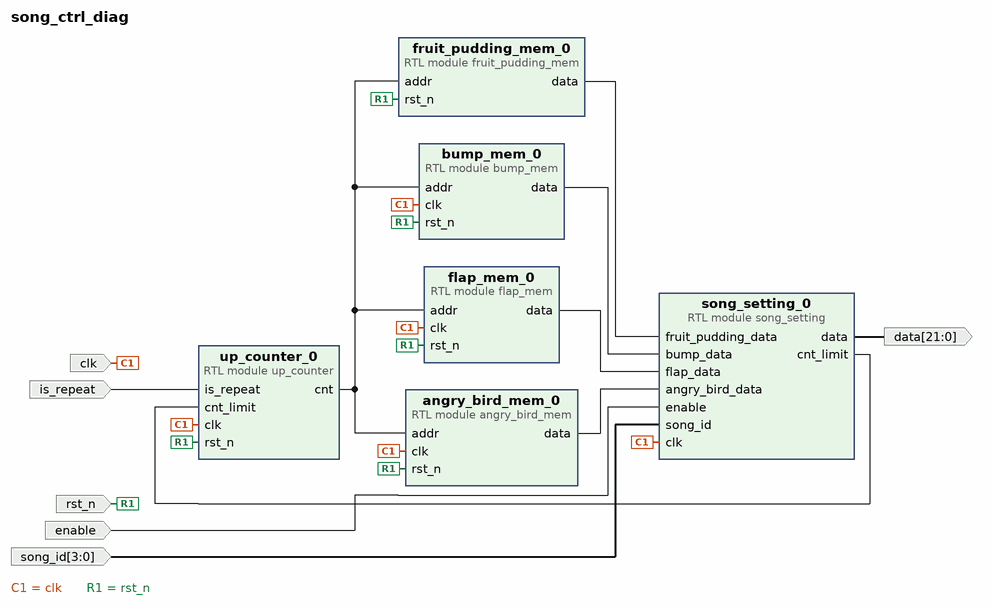
[diagram p0: block diagram of the top level]
# Vivado block design song_ctrl_diag, xc7a35tcpg236-1, Vivado 2019.2
create_bd_design song_ctrl_diag

create_bd_port -dir I clk
create_bd_port -dir I rst_n
create_bd_port -dir I is_repeat
create_bd_port -dir I enable
create_bd_port -dir I -from 3 -to 0 song_id
create_bd_port -dir O -from 21 -to 0 data

create_bd_cell -type module -reference bump_mem bump_mem_0
set_property -dict {CONFIG.MUSIC_ADDR_BITS_N 10 CONFIG.MUSIC_DATA_BITS_N 22} [get_bd_cells bump_mem_0]
create_bd_cell -type module -reference up_counter up_counter_0
set_property -dict {CONFIG.CNT_BITS_N 10} [get_bd_cells up_counter_0]
create_bd_cell -type module -reference fruit_pudding_mem fruit_pudding_mem_0
set_property -dict {CONFIG.MUSIC_ADDR_BITS_N 10 CONFIG.MUSIC_DATA_BITS_N 22} [get_bd_cells fruit_pudding_mem_0]
create_bd_cell -type module -reference song_setting song_setting_0
set_property -dict {CONFIG.MUSIC_ADDR_BITS_N 10 CONFIG.MUSIC_DATA_BITS_N 22 CONFIG.SONG_ID_BITS_N 4} [get_bd_cells song_setting_0]
create_bd_cell -type module -reference angry_bird_mem angry_bird_mem_0
set_property -dict {CONFIG.MUSIC_ADDR_BITS_N 10 CONFIG.MUSIC_DATA_BITS_N 22} [get_bd_cells angry_bird_mem_0]
create_bd_cell -type module -reference flap_mem flap_mem_0
set_property -dict {CONFIG.MUSIC_ADDR_BITS_N 10 CONFIG.MUSIC_DATA_BITS_N 22} [get_bd_cells flap_mem_0]

# ---- connections ----

connect_bd_net [get_bd_pins up_counter_0/cnt] \
  [get_bd_pins fruit_pudding_mem_0/addr] [get_bd_pins bump_mem_0/addr] [get_bd_pins flap_mem_0/addr] \
  [get_bd_pins angry_bird_mem_0/addr]
connect_bd_net [get_bd_pins fruit_pudding_mem_0/data] [get_bd_pins song_setting_0/fruit_pudding_data]
connect_bd_net [get_bd_pins bump_mem_0/data] [get_bd_pins song_setting_0/bump_data]
connect_bd_net [get_bd_pins angry_bird_mem_0/data] [get_bd_pins song_setting_0/angry_bird_data]
connect_bd_net [get_bd_pins flap_mem_0/data] [get_bd_pins song_setting_0/flap_data]
connect_bd_net [get_bd_ports clk] \
  [get_bd_pins up_counter_0/clk] [get_bd_pins angry_bird_mem_0/clk] [get_bd_pins flap_mem_0/clk] [get_bd_pins bump_mem_0/clk] \
  [get_bd_pins song_setting_0/clk]
connect_bd_net [get_bd_ports rst_n] \
  [get_bd_pins up_counter_0/rst_n] [get_bd_pins fruit_pudding_mem_0/rst_n] [get_bd_pins angry_bird_mem_0/rst_n] \
  [get_bd_pins flap_mem_0/rst_n] [get_bd_pins bump_mem_0/rst_n]
connect_bd_net [get_bd_ports is_repeat] [get_bd_pins up_counter_0/is_repeat]
connect_bd_net [get_bd_pins song_setting_0/cnt_limit] [get_bd_pins up_counter_0/cnt_limit]
connect_bd_net [get_bd_ports enable] [get_bd_pins song_setting_0/enable]
connect_bd_net [get_bd_ports song_id] [get_bd_pins song_setting_0/song_id]
connect_bd_net [get_bd_pins song_setting_0/data] [get_bd_ports data]

validate_bd_design
save_bd_design
